# Altium schematic sheet 04-Accel.SchDoc
size A
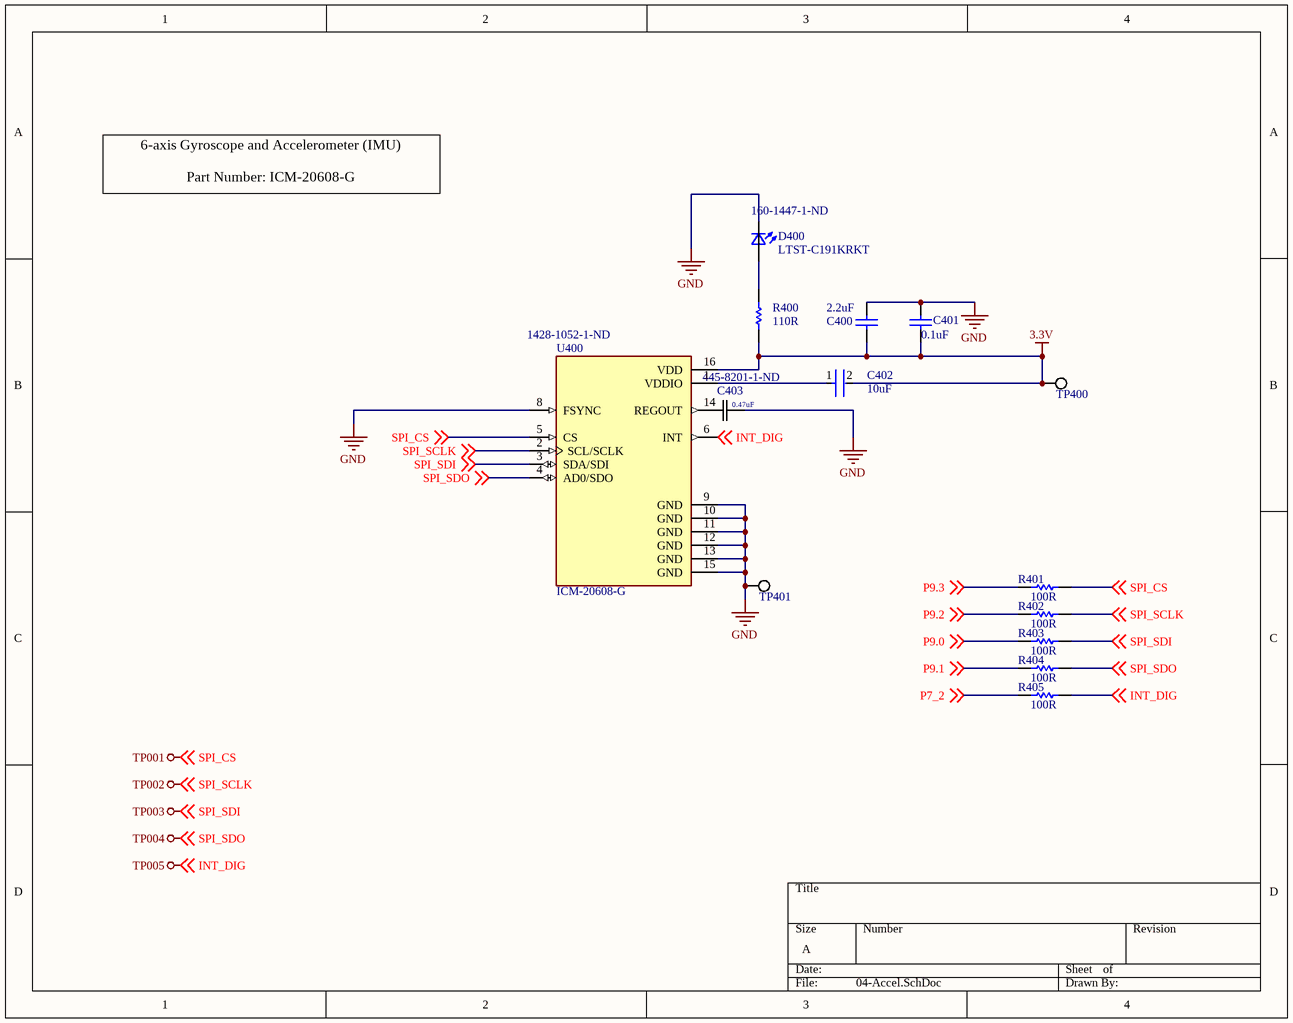
[diagram p0: 04-Accel.SchDoc]

## Parts
C400  2.2uF  [CAPC2013X145X50ML20T25]
C401  0.1uF  [CAPC2013X145X50LL20T25]
C402  10uF  [FP-C0805C-DN-MFG]
C403  0.47uF  Supplier Part Number 2: 445-8201-1-ND  [CAP_2012_TDK]
D400  LTST-C191KRKT  Supplier Part Number 1: 160-1447-1-ND  [0603]
R400  110R  [RESC2013X60X40NL20T25]
R401  100R  [RESC2013X60X40ML20T25]
R402  100R  [RESC2013X60X40ML20T25]
R403  100R  [RESC2013X60X40ML20T25]
R404  100R  [RESC2013X60X40ML20T25]
R405  100R  [RESC2013X60X40ML20T25]
TP400  5019  [KSTN-5019_V]  (value not drawn)
TP401  5019  [KSTN-5019_V]  (value not drawn)
U400  ICM-20608-G  Supplier Part Number 1: 1428-1052-1-ND  [PQFN50P300X300X80-16N]

## Nets
3.3V: C400.1 C401.1 C402.2 R400.1 TP400.1 U400.16(VDD)
GND: C400.2 C401.2 C403.2 D400.1(K2) TP401.1 U400.8(FSYNC) U400.9(GND) U400.10(GND) U400.11(GND) U400.12(GND) U400.13(GND) U400.15(GND)
TP001: R401.2 U400.5(CS) ; off-sheet SPI_CS  [also labelled SPI_CS]
TP002: R402.2 U400.2(SCL/SCLK) ; off-sheet SPI_SCLK  [also labelled SPI_SCLK]
TP003: R403.2 U400.3(SDA/SDI) ; off-sheet SPI_SDI  [also labelled SPI_SDI]
TP004: R404.2 U400.4(AD0/SDO) ; off-sheet SPI_SDO  [also labelled SPI_SDO]
TP005: R405.2 U400.6(INT) ; off-sheet INT_DIG  [also labelled INT_DIG]
P7_2: R405.1 ; off-sheet P7_2
P9.0: R403.1 ; off-sheet P9.0
P9.1: R404.1 ; off-sheet P9.1
P9.2: R402.1 ; off-sheet P9.2
P9.3: R401.1 ; off-sheet P9.3
NetC402_1: C402.1 U400.1(VDDIO)
NetD400_2: D400.2(A2) R400.2

Not connected (* = marked no-connect by the designer): C403 1; U400 14(REGOUT)

## Notes on the sheet
- 6-axis Gyroscope and Accelerometer (IMU)
  Part Number: ICM-20608-G

## Library data of the parts
C400 = CMP-1036-04819-2: Part Number: C0805C225K9PACTU; Manufacturer: Kemet
C401 = CMP-1036-04391-2: Manufacturer: Kemet; Part Number: C0805C104K9RACTU
C402 = CMP-1036-03808-3: CAP CER 10000PF 10V X7R 0805; Manufacturer Part Number: C0805C103K8RACTU; Manufacturer: KEMET; Material: Ceramic; Value: 10,000 pF; Temperature Coefficient: 30ppm/°C; Tolerance: 0.1; RoHS: TRUE; Lead Free: Yes; Temperature: -55°C to +125°C; Device Class L2: Capacitors; Temperature Characteristic: X7R; Device Class L1: Passive Components; Mouser Description: Multilayer Ceramic Capacitors MLCC - SMD/SMT 10volts 10000pF X7R 10%; Category: Cap; Ipc Land Pattern Name: CAPC200125X78; Height: 0.88mm; ComponentLink2URL: https://content.kemet.com/datasheets/KEM_C1003_C0G_SMD.pdf; Capacitance: 10,000 pF; Temperature Range High: +125°C; Automotive: No; ComponentLink2Description: Datasheet; Octopart: https://octopart.com/c0805c103k8ractu-kemet-12595572; Device Class L3: Ceramic Capacitors; Temperature Range Low: -55°C; Package: C0805C-DN; Voltage Rating: 10 V; Digikey Description: CAP CER 10000PF 10V X7R 0805
C403 = CGJ4J2X7R0J474K125AA: Cap Ceramic 0.47uF 6.3V X7R 10% Pad SMD 0805 125C Automotive T/R; Mfr_Name: TDK; Capacitance: 470nF; Ratings: COTS; Supplier 1: Digi-Key; Supplier 2: Digi-Key; Manufacturer: TDK; Manufacturer Part Number: CGJ4J2X7R0J474K125AA; RoHS: Yes; Category: Ceramic Capacitors; Stock 2: 1790; Pricing 2: 1=0.43000, 10=0.30400, 50=0.23020, 100=0.20040, 500=0.14848, 1000=0.12620 (USD); Mount: Surface Mount; Case/Package: 0805; Case Code (Metric): 2012; Case Code (Imperial): 0805; Weight: 0.000194oz; Min Operating Temperature: -55°C; Max Operating Temperature: 125°C; Voltage Rating: 6.3V; Tolerance: 10%; Packaging: Tape and Reel; Termination: SMD/SMT; Series: CGJ; Package Quantity: 2000; Voltage Rating (DC): 6.3V; Dielectric: X7R; Resistor Type: Ceramic; Length: 2mm; Width: 0.049inch; Height: 1.25mm; Thickness: 0.053inch; Depth: 1.25mm; Radiation Hardening: No; ComponentLink1URL: https://datasheet.ciiva.com/15192/getdatasheetpartid-712880-15192524.pdf?src-supplier=Verical; ComponentLink1Description: https://datasheet.ciiva.com/15192/getdatasheetpartid-712880-15192524.pdf?src-supplier=Verical; ComponentLink2URL: https://datasheet.ciiva.com/24216/mlcc-highreliability-general-en-520187-24216918.pdf?src-supplier=Mouser; ComponentLink2Description: https://datasheet.ciiva.com/24216/mlcc-highreliability-general-en-520187-24216918.pdf?src-supplier=Mouser
D400 = LTST-C191KRKT: LED Uni-Color Red 639nm 2-Pin Chip LED T/R / LED RED CLEAR 0603 SMD; Manufacturer: Vishay Lite-On; Lens Color: Colorless; Power Rating: 75mW; Luminous Intensity: 54mcd; Viewing Angle: 130°; Forward Voltage: 2V; Lens Style: Clear,Diffused,Colorless,Rectangular; Forward Current: 30mA; Dominant Wavelength: 631nm; Test Current: 20mA; Number of Elements: 1; Reverse Voltage: 5V; Package: None; MP: LTST-C191KRKT; Value: *; Availability: Unavailable; Price: None; Supplier 1: Digi-Key; Manufacturer Part Number: LTST-C191KRKT; RoHS: Yes; Category: LEDs; Stock 1: 862758; Pricing 1: 1=0.26000, 10=0.14100, 100=0.06560, 500=0.06060, 1000=0.04747, 2000=0.04646 (USD); Mount: Surface Mount; Case/Package: 0603; Number of Pins: 2; Color: Red; Case Code (Metric): 1608; Case Code (Imperial): 0603; Min Operating Temperature: -55°C; Max Operating Temperature: 85°C; Packaging: Tape and Reel; Package Quantity: 1; Illumination Color: Red; Lens Transparency: Clear; Power Dissipation: 75mW; Wavelength: 639nm; Number of LEDs: 1; Voltage: 2V; Length: 1.6mm; Width: 0.8mm; Height: 0.55mm; Depth: 0.8mm; Radiation Hardening: No; Lead Free: Lead Free; RoHS Compliant: Yes; ComponentLink1URL: https://datasheet.ciiva.com/12400/lite-on-ltst-c191krkt-190135-12400910.pdf?src-supplier=Mouser; ComponentLink1Description: https://datasheet.ciiva.com/12400/lite-on-ltst-c191krkt-190135-12400910.pdf?src-supplier=Mouser; ComponentLink2URL: https://datasheet.ciiva.com/16212/ltst-c191krkt-16212419.pdf?src-supplier=Future+Electronics; ComponentLink2Description: https://datasheet.ciiva.com/16212/ltst-c191krkt-16212419.pdf?src-supplier=Future+Electronics; ComponentLink3URL: https://datasheet.ciiva.com/15117/getdatasheetpartid-141922-15117737.pdf?src-supplier=Verical; ComponentLink3Description: https://datasheet.ciiva.com/15117/getdatasheetpartid-141922-15117737.pdf?src-supplier=Verical; ComponentLink4URL: https://datasheet.ciiva.com/11773/0900766b80dc02b2-11773601.pdf?src-supplier=Rs; ComponentLink4Description: https://datasheet.ciiva.com/11773/0900766b80dc02b2-11773601.pdf?src-supplier=Rs; ComponentLink5URL: https://datasheet.ciiva.com/2109/s-110-ltst-c191krkt-2109971.pdf?src-supplier=Digi-Key; ComponentLink5Description: https://datasheet.ciiva.com/2109/s-110-ltst-c191krkt-2109971.pdf?src-supplier=Digi-Key; ComponentLink6URL: https://datasheet.ciiva.com/2109/s-110-ltst-c191krkt-2109970.pdf?src-supplier=Digi-Key; ComponentLink6Description: https://datasheet.ciiva.com/2109/s-110-ltst-c191krkt-2109970.pdf?src-supplier=Digi-Key; ComponentLink7URL: https://datasheet.ciiva.com/2109/s-110-ltst-c191krkt-2109972.pdf?src-supplier=Digi-Key; ComponentLink7Description: https://datasheet.ciiva.com/2109/s-110-ltst-c191krkt-2109972.pdf?src-supplier=Digi-Key
R400 = CMP-2001-00585-1: Part Number: ERA6AEB111V; Manufacturer: Panasonic
R401-R405 = CMP-2001-00580-1: Manufacturer: Panasonic; Part Number: ERA6AEB101V
TP400 TP401 = CMP-1672-00008-1: Test Point, 1 Position SMD, RoHS, Tape and Reel; Manufacturer 1: Keystone Electronics; ComponentLink1Description: Manufacturer URL; Package Quantity: 1000; DatasheetVersion: 03/2014; Packaging: Tape and Reel; ComponentLink2URL: http://www.keyelco.com/product-pdf.cfm?p=1357; ComponentLink1URL: http://www.keyelco.com/; Mount: Surface Mount; Contact Plating: Silver; PackageDescription: 1-Pin Surface Mount Device, Body 3.81 x 2.03 mm; Pins: 1; RoHSCompliant: True; Mounting Technology: Surface Mount; ComponentLink2Description: Datasheet; PackageReference: 5019; Supplier 1: Digi-Key; Supplier Part Number 1: 36-5019CT-ND; Manufacturer Part Number 1: 5019; RoHS: Yes; Category: Connectors; Stock 1: 1316816; Pricing 1: 1=0.34000, 25=0.27360, 100=0.22340, 250=0.20064, 500=0.19152 (USD); Number of Pins: 1; Material: Bronze; Contact Material: Bronze; Series: 5019; Termination: SMD/SMT; Height: 0.09inch; RoHS Compliant: Yes; REACH SVHC: No SVHC; Lead Free: Lead Free; ComponentLink3URL: https://datasheet.ciiva.com/16318/m60-2p61-16318395.pdf?src-supplier=Future+Electronics; ComponentLink3Description: https://datasheet.ciiva.com/16318/m60-2p61-16318395.pdf?src-supplier=Future+Electronics; ComponentLink4URL: https://datasheet.ciiva.com/16885/70182998-16885945.pdf?src-supplier=Allied+Electronics; ComponentLink4Description: https://datasheet.ciiva.com/16885/70182998-16885945.pdf?src-supplier=Allied+Electronics; ComponentLink5URL: https://datasheet.ciiva.com/14848/m60-2p61-14848437.pdf?src-supplier=Digi-Key; ComponentLink5Description: https://datasheet.ciiva.com/14848/m60-2p61-14848437.pdf?src-supplier=Digi-Key; ComponentLink6URL: https://datasheet.ciiva.com/14848/m60-2p61-14848438.pdf?src-supplier=Digi-Key; ComponentLink6Description: https://datasheet.ciiva.com/14848/m60-2p61-14848438.pdf?src-supplier=Digi-Key; ComponentLink7URL: https://datasheet.ciiva.com/14848/m60-2p61-14848439.pdf?src-supplier=Digi-Key; ComponentLink7Description: https://datasheet.ciiva.com/14848/m60-2p61-14848439.pdf?src-supplier=Digi-Key
U400 = ICM-20608-G: MotionTracking Device Digital Output 1.8V 16-Pin LGA / IMU ACCEL/GYRO I2C/SPI 16LGA; MF: TDK InvenSense; Sensor Type: Accelerometer,Gyroscope,3 Axis; Output Type: SPI,I2C,Digital; Package: LGA-16 InvenSense; Purchase-URL: https://pricing.snapeda.com/search/part/ICM-20608-G/?ref=eda; Value: *; Price: None; Availability: Good; MP: ICM-20608-G; SnapEDA_Link: https://www.snapeda.com/parts/ICM-20608-G/TDK%20InvenSense/view-part/196551/?ref=snap; Supplier 1: Digi-Key; Manufacturer: TDK InvenSense; Manufacturer Part Number: ICM-20608-G; RoHS: No; Category: Inertial Measurement Units (IMUs); Stock 1: 18416; Pricing 1: 1=7.78000, 5=6.86600, 10=6.06500, 25=4.92040, 50=4.34820, 100=4.23370, 500=3.54718, 1000=3.31832 (USD); Mount: Surface Mount; Case/Package: LGA; Number of Pins: 16; Min Operating Temperature: -40°C; Max Operating Temperature: 85°C; RoHS Compliant: No; ComponentLink1URL: https://www.invensense.com/wp-content/uploads/2015/03/ICM-20608-G-Product-Brief-v1.0.pdf?src-supplier=Digi-Key; ComponentLink1Description: https://www.invensense.com/wp-content/uploads/2015/03/ICM-20608-G-Product-Brief-v1.0.pdf?src-supplier=Digi-Key